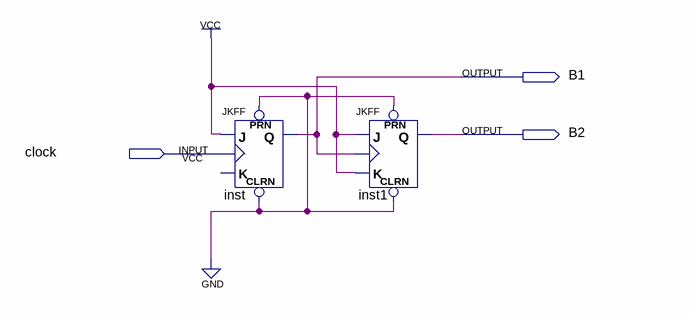
[diagram p0: schematic sheet]
// Quartus schematic contador.bdf as structural Verilog: 2 symbols, 3 pins
module contador (
  input  clock,
  output B1,
  output B2
);

  JKFF inst (.PRN(1'b0), .CLRN(1'b0), .J(1'b1), .CLK(clock), .Q(B1));  // open: K
  JKFF inst1 (.PRN(1'b0), .CLRN(1'b0), .K(1'b1), .J(1'b1), .CLK(B1), .Q(B2));
endmodule
